# EAGLE design W504X (EAGLE 6.6.0)
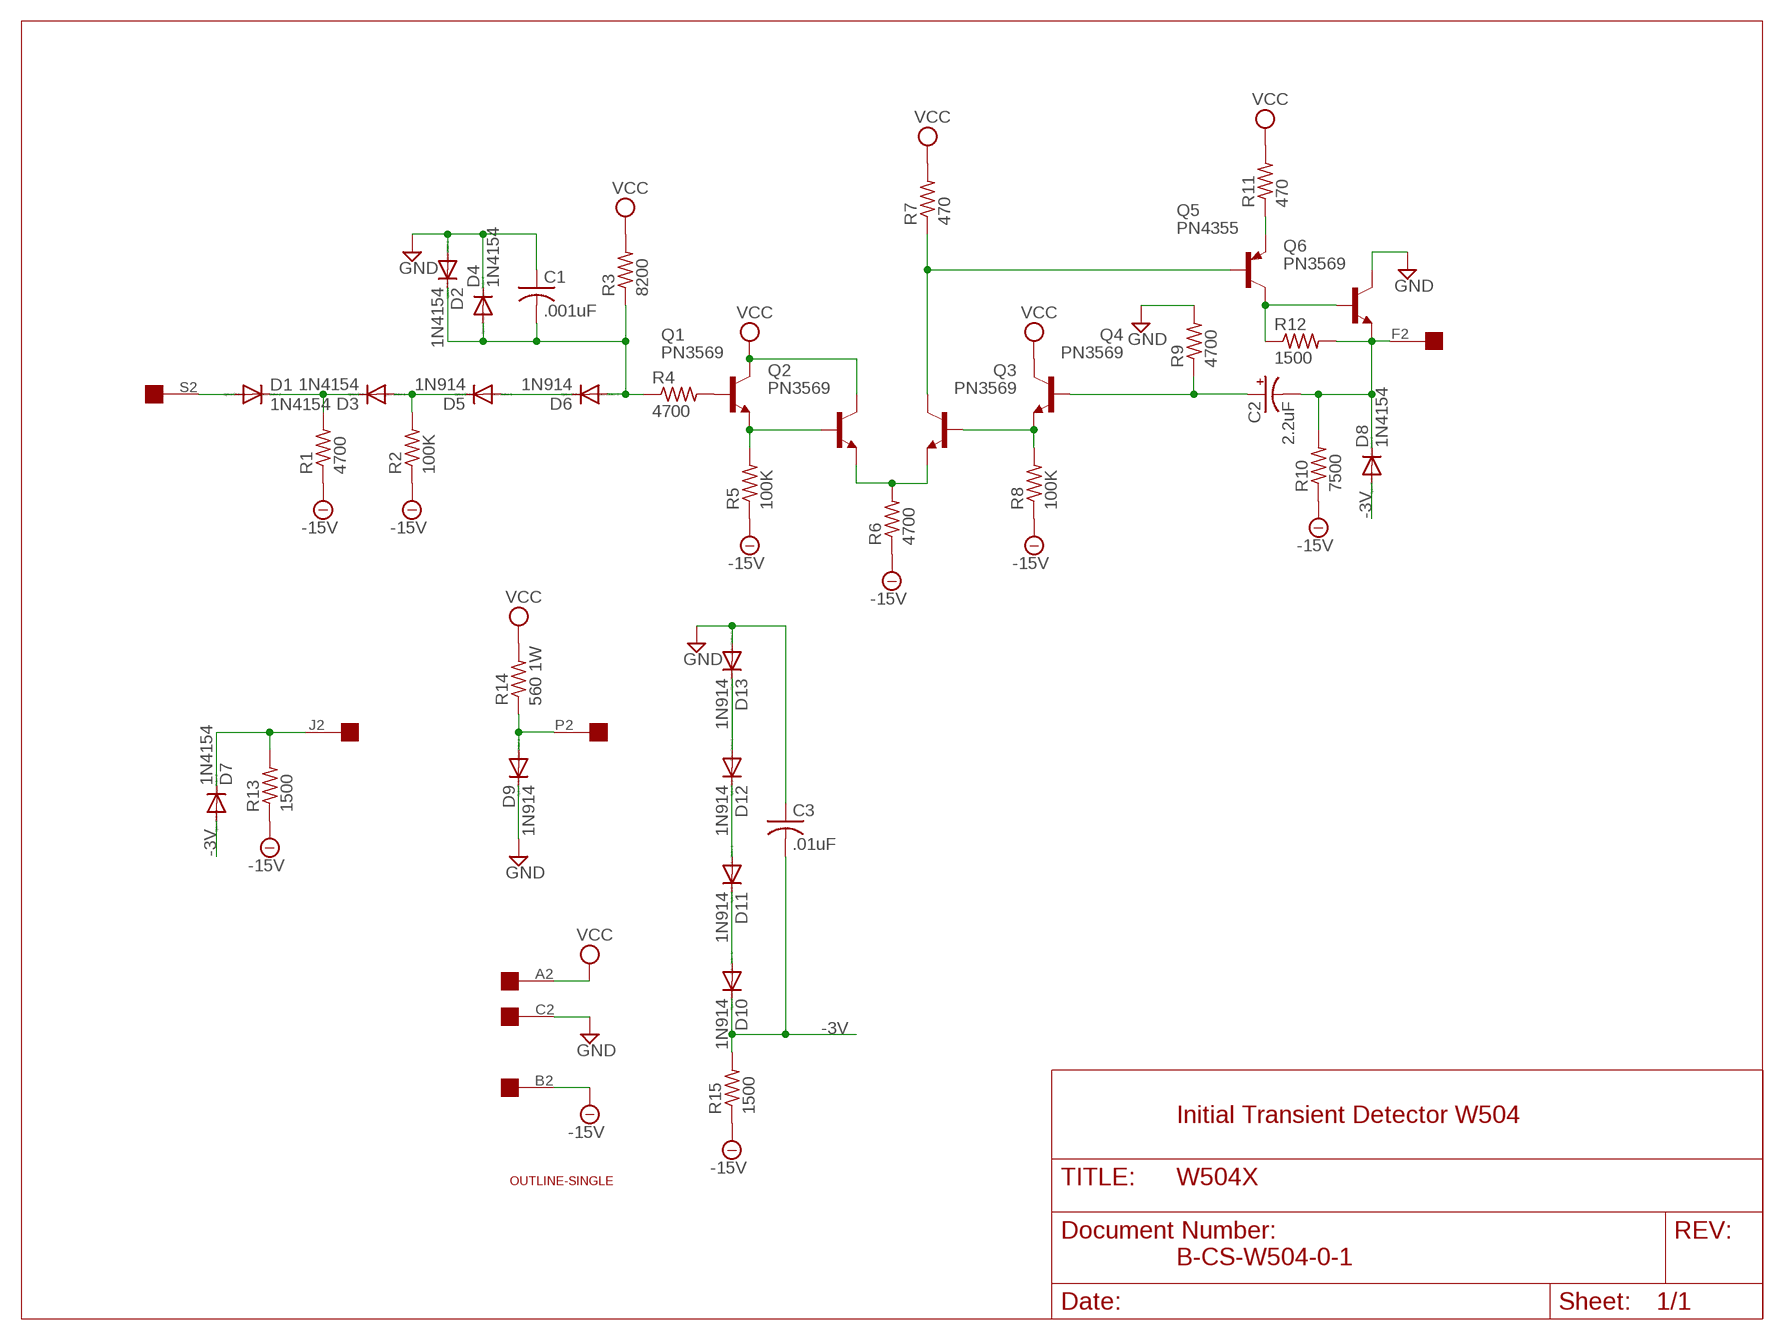
[diagram p0: schematic, sheet 1]

## Parts
C1  .001uF  C-US150-054X183  [C150-054X183]
C2  2.2uF  CPOL-USE12-4AXIAL  [E12-4]
C3  .01uF  C-US150-054X183  [C150-054X183]
D1  1N4154  DIODE-DO35-10  [DO35-10]
D2  1N4154  DIODE-DO35-10  [DO35-10]
D3  1N4154  DIODE-DO35-10  [DO35-10]
D4  1N4154  DIODE-DO35-10  [DO35-10]
D5  1N914  DIODE-DO35-10  [DO35-10]
D6  1N914  DIODE-DO35-10  [DO35-10]
D7  1N4154  DIODE-DO35-10  [DO35-10]
D8  1N4154  DIODE-DO35-10  [DO35-10]
D9  1N914  DIODE-DO35-10  [DO35-10]
D10  1N914  DIODE-DO35-10  [DO35-10]
D11  1N914  DIODE-DO35-10  [DO35-10]
D12  1N914  DIODE-DO35-10  [DO35-10]
D13  1N914  DIODE-DO35-10  [DO35-10]
Q1  PN3569  -NPN-TO5  [TO5]
Q2  PN3569  -NPN-TO5  [TO5]
Q3  PN3569  -NPN-TO5  [TO5]
Q4  PN3569  -NPN-TO5  [TO5]
Q5  PN4355  -PNP-TO5  [TO5]
Q6  PN3569  -NPN-TO5  [TO5]
R1  4700  R-US_0207/10  [0207/10]
R2  100K  R-US_0207/10  [0207/10]
R3  8200  R-US_0207/10  [0207/10]
R4  4700  R-US_0207/10  [0207/10]
R5  100K  R-US_0207/10  [0207/10]
R6  4700  R-US_0207/10  [0207/10]
R7  470  R-US_0207/10  [0207/10]
R8  100K  R-US_0207/10  [0207/10]
R9  4700  R-US_0207/10  [0207/10]
R10  7500  R-US_0207/10  [0207/10]
R11  470  R-US_0207/10  [0207/10]
R12  1500  R-US_0207/10  [0207/10]
R13  1500  R-US_0207/10  [0207/10]
R14  560 1W  R-US_0617/22  [0617/22]
R15  1500  R-US_0207/10  [0207/10]
U$1  OUTLINE-SINGLE  [SINGLE]
U$2  EDGE-1  [EDGE-CON1]

## Nets
-3V: C3.2 D7.A D8.A D10.C R15.2
-15V: R1.1 R2.1 R5.1 R6.1 R8.1 R10.1 R13.1 R15.1 U$2.B2
GND: C1.1 C3.1 D2.A D4.C D9.C D13.A Q6.3(C) R9.2 U$2.C2
N$1: D1.C D3.C R1.2
N$2: D3.A D5.C R2.2
N$3: D5.A D6.C
N$4: C1.2 D2.C D4.A D6.A R3.1 R4.1
N$5: Q1.1(E) Q2.2(B) R5.2
N$6: Q1.2(B) R4.2
N$7: Q2.1(E) Q3.1(E) R6.2
N$8: Q3.3(C) Q5.2(B) R7.1
N$9: Q3.2(B) Q4.1(E) R8.2
N$10: C2.+ Q4.2(B) R9.1
N$11: C2.- D8.C Q6.1(E) R10.2 R12.2 U$2.F2
N$12: Q5.1(E) R11.1
N$13: Q5.3(C) Q6.2(B) R12.1
N$14: D7.C R13.2 U$2.J2
N$15: D9.A R14.1 U$2.P2
N$17: D12.A D13.C
N$18: D11.A D12.C
N$19: D10.A D11.C
S2: D1.A U$2.S2
VCC: Q1.3(C) Q2.3(C) Q4.3(C) R3.2 R7.2 R11.2 R14.2 U$2.A2
Unconnected: U$2.D2 U$2.E2 U$2.H2 U$2.K2 U$2.L2 U$2.M2 U$2.N2 U$2.R2 U$2.T2 U$2.U2 U$2.V2

## Notes on the sheet
- Initial Transient Detector W504
- B-CS-W504-0-1

## Library data of the parts
C1 C3 = rcl:C-US: CAPACITOR, American symbol
C2 = dec-con:CPOL-USE12-4AXIAL: 0.5" veresion of an electrolytic
D1-D13 = diode:DIODE-: DIODE
Q1-Q4 Q6 = transistor:*-NPN-: NPN Transistror BF959 corrected 2008.03.06
Q5 = transistor:*-PNP-: PNP Transistror
R1-R15 = rcl:R-US_: RESISTOR, American symbol
U$1 = dec-con:OUTLINE-*: Board outlines for DEC boards.
U$2 = dec-con:EDGE-1: Single-Sided DEC Edge Connector -- (side 2)

## Net classes
0 default: width 0.813 mm

## Board
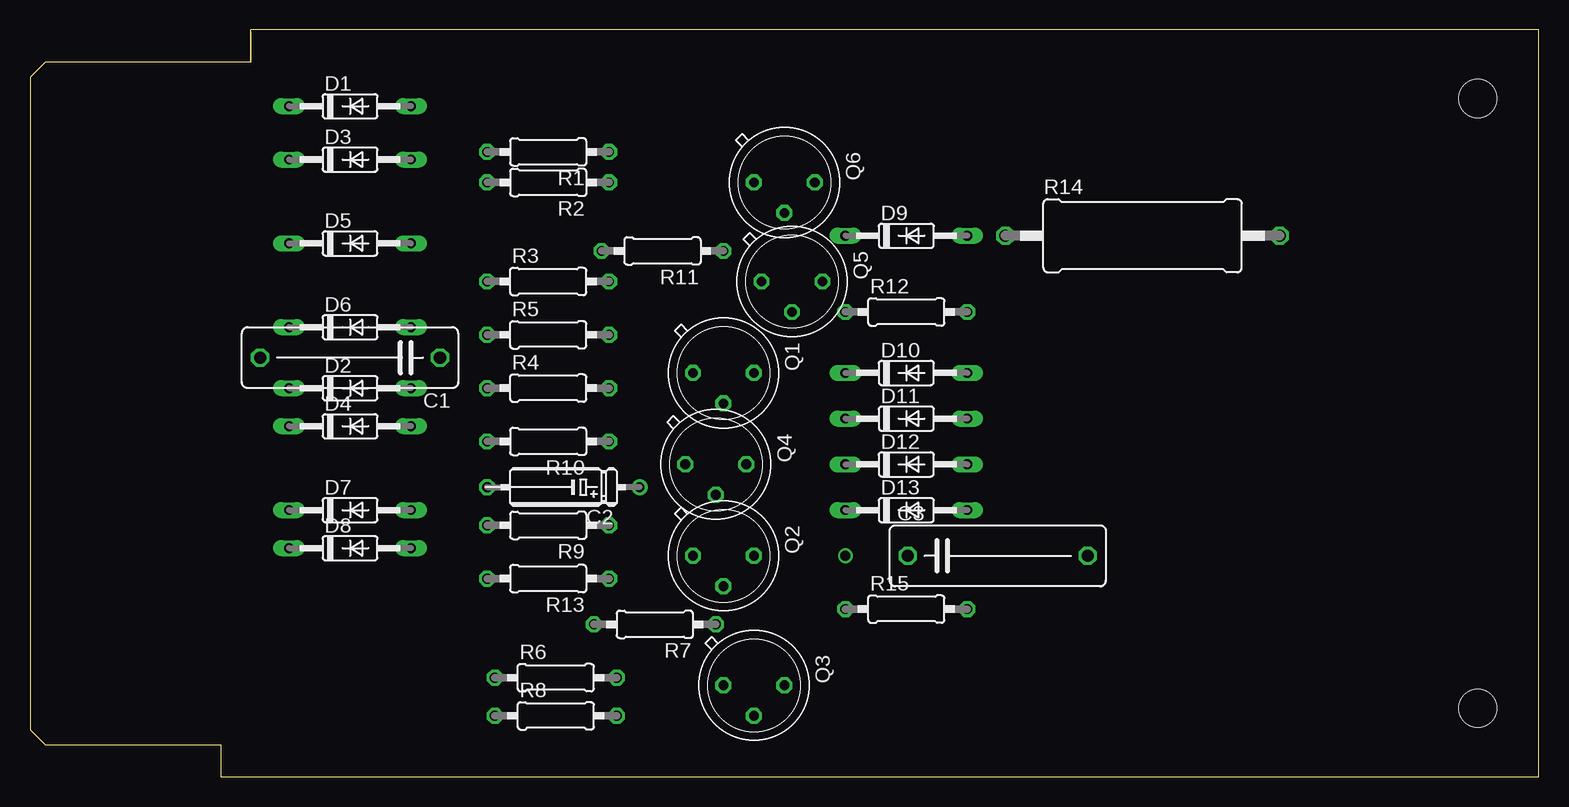
[diagram p1: board, top side]
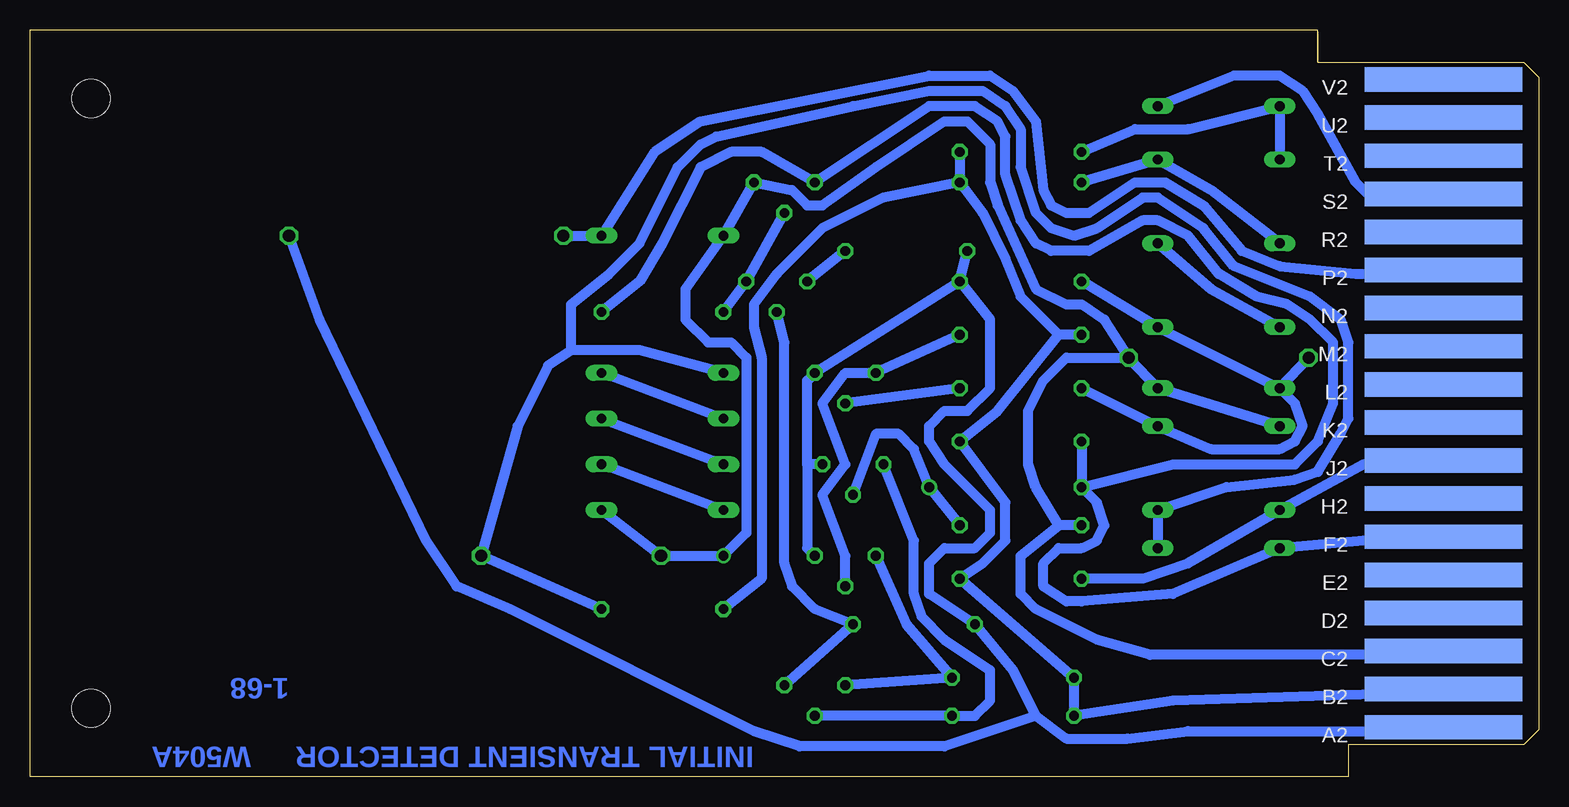
[diagram p2: board, bottom side, seen from below]

Size 125.73 x 62.23 mm. Coordinates in mm from the lower left corner, seen from the top.
Copper layers (1+16): Top 0.035mm / dielectric 1.5mm / Bottom 0.035mm
Design rules "16mils": minimum track width 16mil, minimum drill 32mil, track to track 15mil, track to pad 10mil, pad to pad 10mil, via to via 10mil, smd to smd 10mil, copper to edge 13mil, drill to drill 10mil, minimum pad ring 10mil, minimum via ring 8mil, stop-mask expansion 0mil, vias tented up to drill 0mil, thermal gap 10mil

### Footprints (pad centres in the part's own frame; a part is rotated, then mirrored left to right if it is on the bottom)
C150-054X183 = drill 1.016 octagon: 1 -7.493,0; 2 7.493,0
E12-4 = drill 0.813: + -7.62,0 | drill 0.813 octagon: - 5.08,0
DO35-10 = drill 0.813 long: A 5.08,0; C -5.08,0
TO5 = drill 0.813 octagon: 1 0,-2.54; 2 2.54,0; 3 0,2.54
0207/10 = drill 0.813 octagon: 1 -5.08,0; 2 5.08,0
0617/22 = drill 1.016 octagon: 1 -11.43,0; 2 11.43,0
SINGLE = hole 3.175: 120.65,56.515; 120.65,5.715
EDGE-CON1 = smd 13.106 x 2.032 bottom: A2 7.938,4.128; B2 7.938,7.303; C2 7.938,10.477; D2 7.938,13.652; E2 7.938,16.828; F2 7.938,20.003; H2 7.938,23.177; J2 7.938,26.352; K2 7.938,29.527; L2 7.938,32.703; M2 7.938,35.877; N2 7.938,39.053; P2 7.938,42.227; R2 7.938,45.403; S2 7.938,48.578; T2 7.938,51.752; U2 7.938,54.928; V2 7.938,58.102

### Placement (x,y rotation side)
C1  26.67,34.92 180 top
C2  43.18,24.13 180 top
C3  80.65,18.41 0 top
D1  26.67,55.88 0 top
D2  26.67,32.38 0 top
D3  26.67,51.44 0 top
D4  26.67,29.21 0 top
D5  26.67,44.45 0 top
D6  26.67,37.47 0 top
D7  26.67,22.23 0 top
D8  26.67,19.05 0 top
D9  73.03,45.09 0 top
D10  73.03,33.66 0 top
D11  73.03,29.84 0 top
D12  73.03,26.04 0 top
D13  73.03,22.23 0 top
Q1  57.79,33.66 270 top
Q2  57.79,18.41 270 top
Q3  60.33,7.62 270 top
Q4  57.15,26.04 270 top
Q5  63.5,41.27 270 top
Q6  62.87,49.53 270 top
R1  43.18,52.07 180 top
R2  43.18,49.53 180 top
R3  43.18,41.27 0 top
R4  43.18,32.38 0 top
R5  43.18,36.83 0 top
R6  43.82,8.26 0 top
R7  52.07,12.7 180 top
R8  43.82,5.08 0 top
R9  43.18,20.95 180 top
R10  43.18,27.94 180 top
R11  52.71,43.81 180 top
R12  73.03,38.73 0 top
R13  43.18,16.51 180 top
R14  92.71,45.09 0 top
R15  73.03,13.97 0 top
U$1  0,0 0 top
U$2  0,0 0 top

### Tracks (layer width: path | path; a pad name or v marks a point on that pad's centre or on a via)
-3V
  Bottom 0.813: D8.A D7.A 26.04,24.13 20.32,24.77 18.42,25.4 16.51,28.57 15.88,29.84 15.88,36.2 16.51,38.1 19.05,40.01 25.4,42.55 27.94,45.72 31.75,48.26 33.02,48.26 36.83,45.72 38.74,45.09 40.64,45.72 41.91,46.99 43.18,50.8 43.18,53.98 44.45,55.88 46.36,57.15 50.8,57.15 57.15,55.88 68.58,53.34 69.85,52.7 71.76,50.8 74.93,44.45 77.47,41.91 80.65,39.37 80.65,35.56 | D10.C 74.93,35.56 80.65,35.56 | 80.65,35.56 82.55,34.29 85.09,29.21 C3.2 R15.2
-15V
  Bottom 0.813: R1.1 R2.1 | R2.1 54.61,48.26 59.69,45.72 63.5,41.91 65.41,39.37 65.41,37.47 64.77,34.92 64.77,16.51 R15.1 | R2.1 46.36,46.99 44.45,43.18 43.18,40.01 40.01,36.83 | 40.01,36.83 45.09,30.48 R10.1 44.45,22.86 44.45,19.68 46.36,17.78 R13.1 R6.1 R8.1 30.48,6.35 9.53,6.99 U$2.B2 | R5.1 40.01,36.83
GND  (via drill 0.81)
  Bottom 0.813: D4.C D2.A C1.1 | D13.A C3.1 v67.95,18.41 66.04,20.32 66.04,34.92 67.31,36.2 69.22,36.2 71.12,38.1 71.12,40.64 D9.C Q6.3 62.23,48.9 60.96,47.62 59.69,47.62 55.25,50.8 49.53,54.61 47.63,54.61 45.72,52.7 45.72,49.53 45.09,47.62 41.91,40.64 39.37,39.37 38.1,39.37 36.2,38.1 C1.1 | R9.2 40.01,20.95 | 40.01,20.95 41.91,24.13 42.55,26.04 42.55,30.48 41.28,33.02 39.37,34.92 C1.1 | U$2.C2 8.89,10.16 32.39,10.16 36.83,11.43 41.91,13.97 43.18,15.24 43.18,18.41 40.01,20.95
N$1
  Bottom 0.813: D3.C D1.C 29.21,53.98 33.66,53.98 R1.2
N$2
  Bottom 0.813: D5.C 27.31,48.9 D3.A R2.2
N$3
  Bottom 0.813: D5.A 27.31,40.64 D6.C
N$4
  Bottom 0.813: C1.2 D2.C | D2.C 20.32,31.11 19.69,29.21 20.32,27.94 21.59,27.3 27.31,27.3 D4.A R4.1 | D2.C D6.A R3.1
N$5
  Bottom 0.813: R5.2 Q1.1 57.79,33.66 59.69,31.11 57.79,26.04 59.69,23.5 57.79,18.41 Q2.2
N$6
  Bottom 0.813: R4.2 Q1.2
N$7
  Bottom 0.813: Q3.1 R6.2 52.71,12.7 Q2.1
N$8
  Bottom 0.813: Q3.3 R7.1 60.33,13.97 62.23,15.88 62.87,17.78 62.87,36.2 Q5.2
N$9
  Bottom 0.813: Q3.2 R8.2 46.99,5.08 45.72,6.35 45.72,8.89 49.53,11.43 51.44,13.34 52.07,15.24 52.07,19.68 Q4.1
N$10
  Bottom 0.813: R9.1 C2.+ 52.07,27.3 53.34,28.57 55.25,28.57 Q4.2
N$11
  Bottom 0.813: U$2.F2 9.53,19.68 14.61,19.68 D8.C 30.48,15.24 38.1,14.61 39.37,14.61 41.28,15.88 41.28,17.78 40.01,19.05 38.1,19.05 36.83,19.68 36.2,20.95 36.83,22.86 C2.- | R10.2 C2.- | C2.- 30.48,26.04 20.32,26.04 18.42,27.94 17.15,31.11 17.15,36.2 19.05,38.1 20.96,39.37 23.5,40.01 26.67,41.91 29.21,45.09 31.75,46.35 33.02,46.35 37.47,43.81 40.64,43.81 41.91,44.45 43.18,46.35 44.45,50.16 44.45,53.34 45.09,54.61 46.99,55.88 50.8,55.88 Q6.1 64.77,52.07 67.31,52.07 69.85,50.8 73.03,44.45 74.93,41.27 R12.2
N$12
  Bottom 0.813: R11.1 Q5.1
N$13
  Bottom 0.813: Q6.2 Q5.3 R12.1
N$14
  Bottom 0.813: U$2.J2 8.89,26.04 14.61,26.04 D7.C 29.21,17.78 33.02,16.51 R13.2
N$15
  Bottom 0.813: R14.1 D9.A 73.66,52.07 69.85,54.61 50.8,58.42 45.72,58.42 43.82,57.15 41.91,54.61 41.28,48.9 40.64,47.62 39.37,46.99 37.47,46.99 33.66,49.53 31.12,49.53 27.94,47.62 24.77,43.81 21.59,42.55 15.24,41.91 8.89,41.91 U$2.P2
N$17
  Bottom 0.813: D13.C D12.A
N$18
  Bottom 0.813: D11.A D12.C
N$19
  Bottom 0.813: D11.C D10.A
S2
  Bottom 0.813: U$2.S2 8.89,48.26 13.97,48.26 15.24,49.53 18.42,55.24 19.69,57.15 21.59,58.42 25.4,58.42 D1.A
VCC
  Bottom 0.813: 41.91,5.08 43.82,8.89 R7.2 50.8,15.24 50.8,17.78 49.53,19.05 46.99,19.05 45.72,20.32 45.72,22.23 49.53,26.04 50.8,27.94 50.8,29.21 49.53,30.48 47.63,30.48 45.72,32.38 45.72,38.1 R3.2 | 41.91,5.08 39.37,3.17 34.29,3.17 29.21,3.81 8.89,3.81 U$2.A2 | 41.91,5.08 49.53,2.54 61.6,2.54 65.41,3.81 85.73,13.97 90.17,15.88 92.71,19.68 101.6,38.1 R14.2 | 60.96,26.04 60.96,33.02 Q1.3 R3.2 | Q4.3 60.96,26.04 | 60.96,26.04 60.96,19.05 Q2.3 | R3.2 R11.2

### Text on the board
Bottom: 1-68 | INITIAL TRANSIENT DETECTOR | W504A
200bmp: C:/Users/Vince/Documents/eagle/projects/DEC/Wxxx/W504/W504Abackfb.bmp